# EasyEDA Pro project ProPrj_Altruist.epro, schematic Schematic Altruist
Board Name: Altruist_core_ESP32C3mini; Create Date: 2024-12-25; Page Name: P1; Project Name: Altruist rc: v0.1.1; Schematic Name: Altruist_Schematic; Update Date: 2025-01-15; Company: Robonomics.network; Drawn: chegurov; Page Size: A4; Part Number: Robo_altruist; Reviewed: ludovich88; Version: V0.1
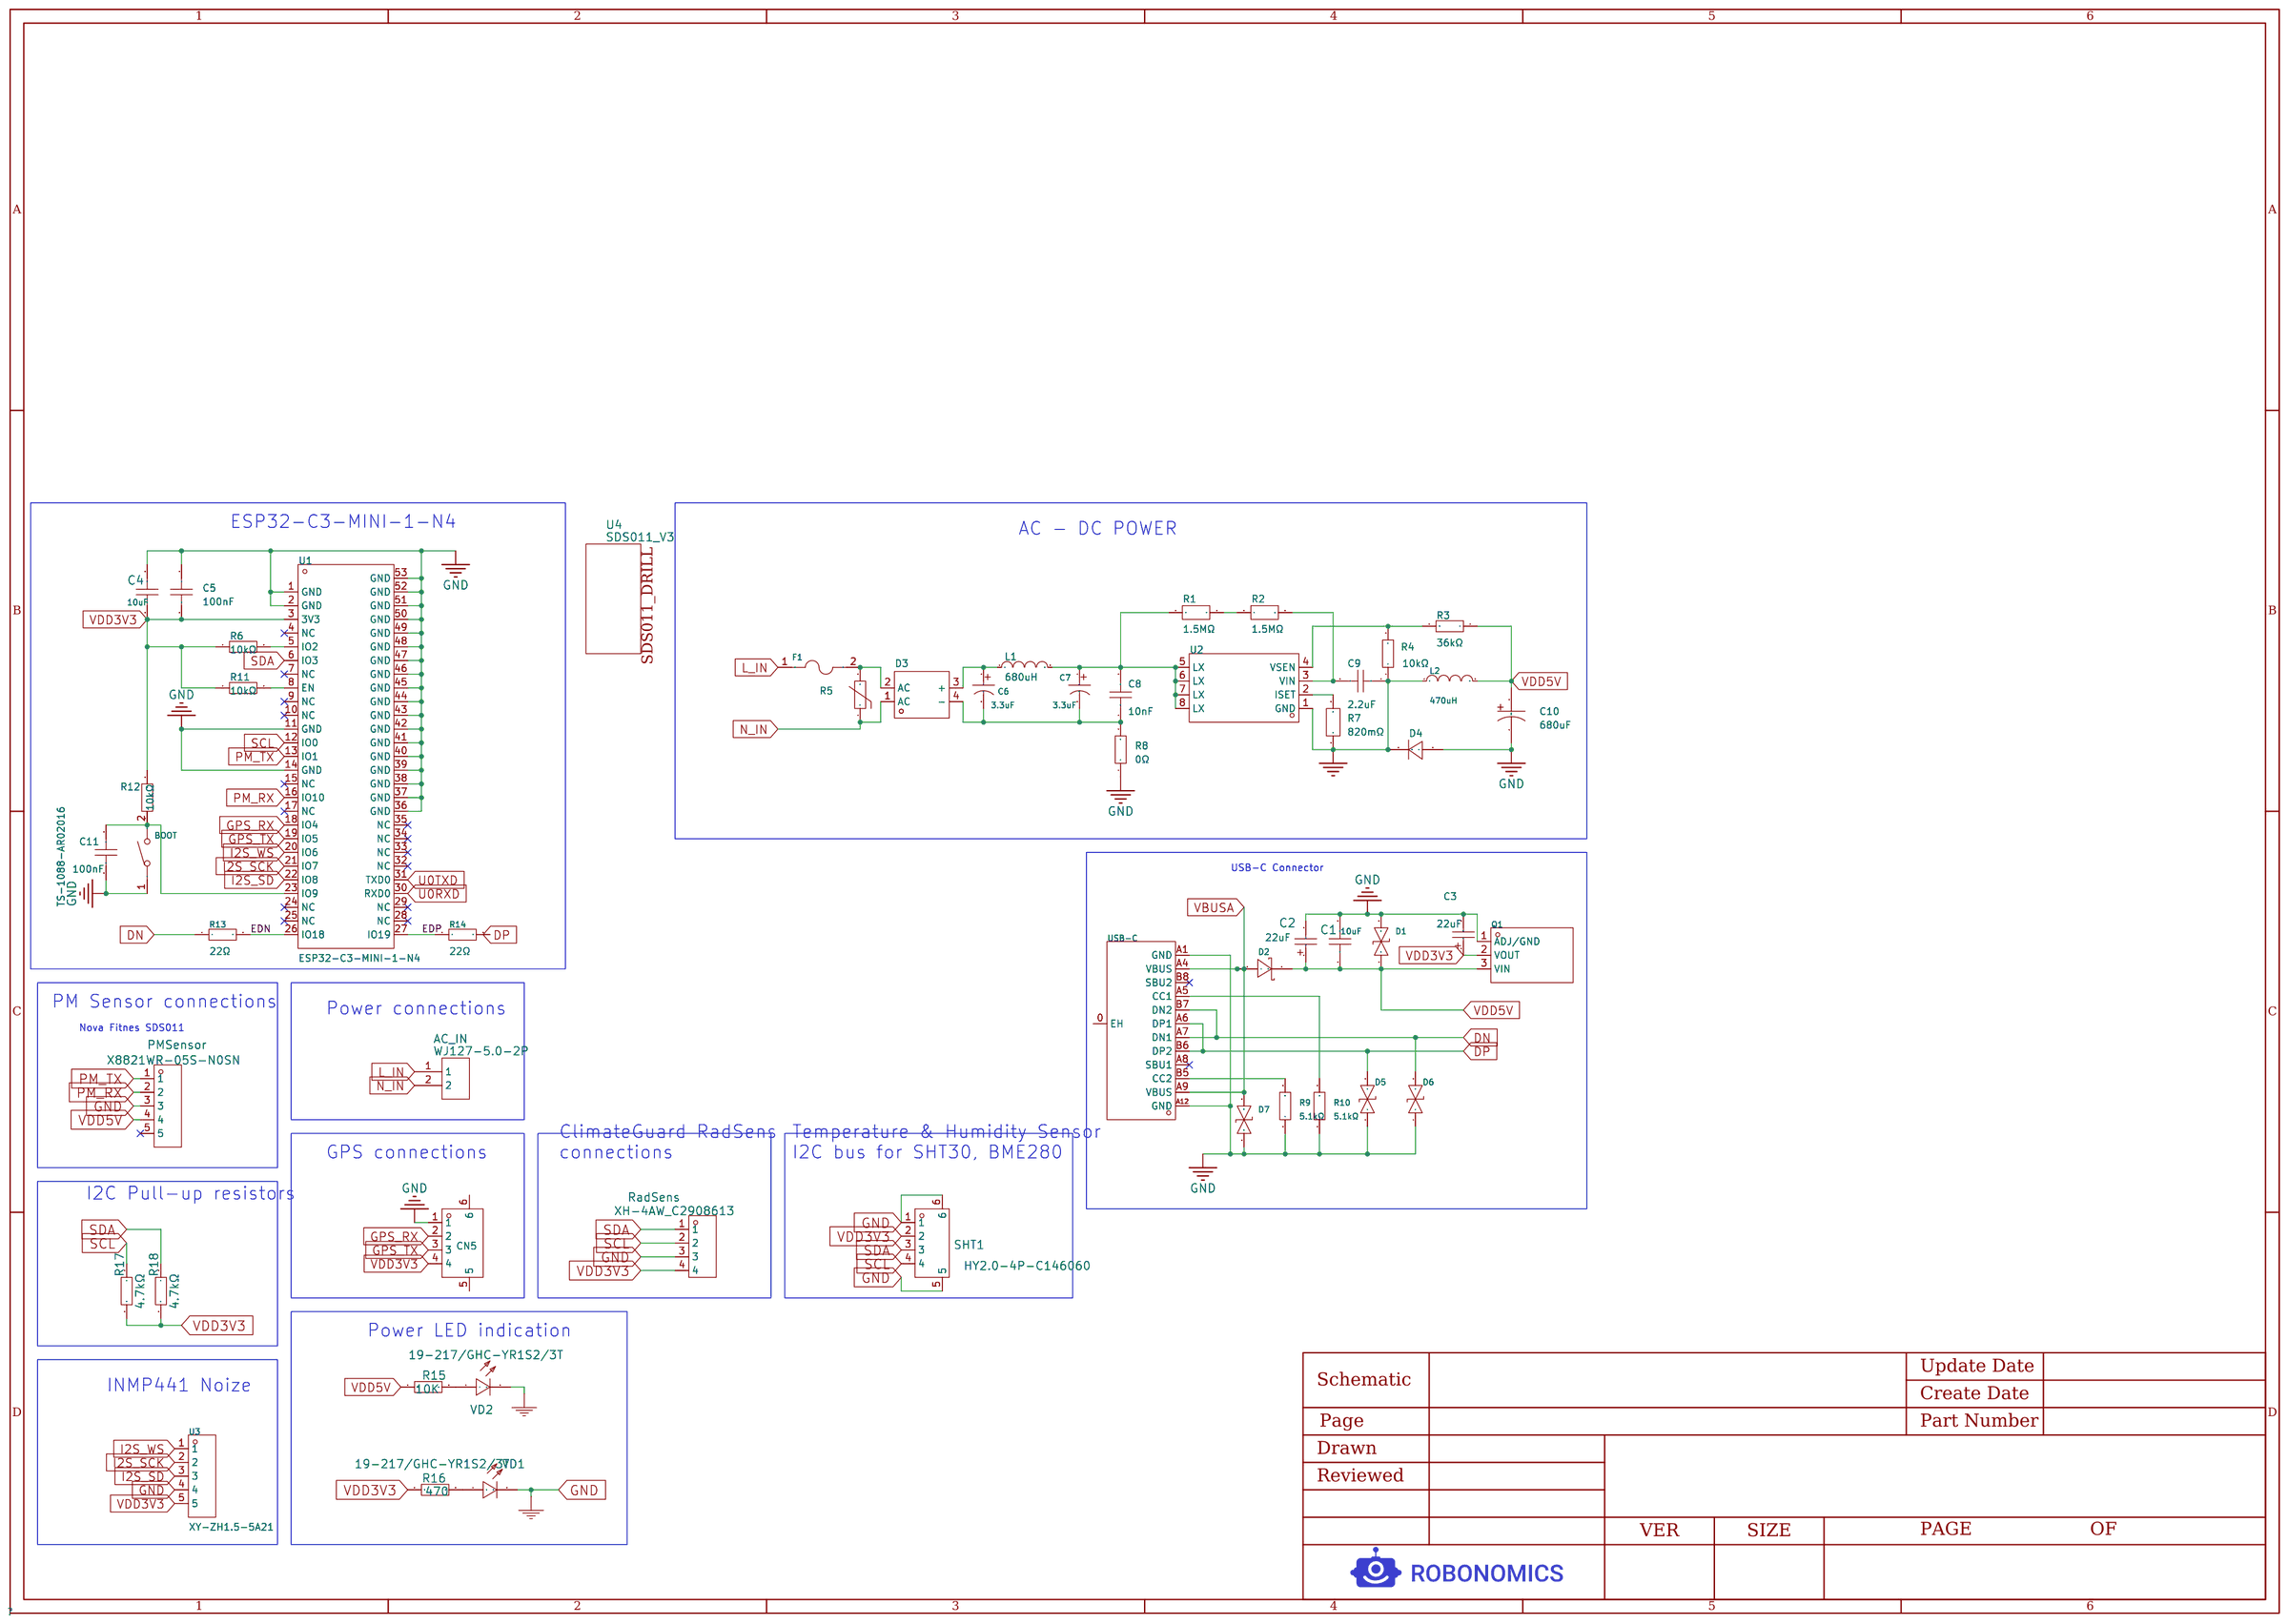
[diagram p2: schematic sheet]

## Parts
AC_IN  WJ127-5.0-2P  [CONN-TH_2P-P5.00_CPC3703CTR]
BOOT  TS-1088-AR02016  [SW-SMD_L3.9-W3.0-P4.45]
C1  22uF  [CASE-A_3216]
C2  10uF  [C0603]
C3  22uF  [CASE-A_3216]
C4  10uF  [C0603]
C5  100nF  [C0402]
C6  3.3uF  [CAP-SMD_BD8.0-L8.3-W8.3-FD]
C7  3.3uF  [CAP-SMD_BD8.0-L8.3-W8.3-FD]
C8  10nF  [C1206]
C9  2.2uF  [C0805]
C10  680uF  [CAP-SMD_L7.3-W4.3]
C11  100nF  [C0402]
CN5  ZX-SH1.0-4PWT  [CONN-SMD_4P-P1.00_MEGASTAR_ZX-SH1.0-4PWT]
D1  LESD5D5.0CT1G  [SOD-523_L1.2-W0.8-LS1.6-BI]
D2  1N5819WS  [SOD-323_L1.8-W1.3-LS2.5-RD]
D3  MB10F  [MBF_L4.8-W3.9-P2.50-LS6.7-BL]
D4  ES1J  [SMA_L4.3-W2.6-LS5.2-RD]
D5  LESD5D5.0CT1G  [SOD-523_L1.2-W0.8-LS1.6-BI]
D6  LESD5D5.0CT1G  [SOD-523_L1.2-W0.8-LS1.6-BI]
D7  LESD5D5.0CT1G  [SOD-523_L1.2-W0.8-LS1.6-BI]
F1  JFC2410-1200FS  [F2410]
L1  680uH  [IND-SMD_L6.0-W6.0]
L2  470uH  [IND-SMD_L8.0-W8.0]
PMSensor  X8821WR-05S-N0SN  [CONN-TH_5P-P2.50_X8821WR-05S-N0SN]
Q1  AMS1117-3.3V  [SOT-89-3_L4.5-W2.5-P1.50-LS4.2-BR]
R1  1.5MΩ  [R1206]
R2  1.5MΩ  [R1206]
R3  36kΩ  [R0805]
R4  10kΩ  [R0805]
R5  07D471K68RV0149  [RES-SMD_L8.2-W6.3]
R6  10kΩ  [R0402]
R7  820mΩ  [R0805]
R8  0Ω  [R0805]
R9  5.1kΩ  [R0402]
R10  5.1kΩ  [R0402]
R11  10kΩ  [R0402]
R12  10kΩ  [R0402]
R13  22Ω  [R0402]
R14  22Ω  [R0402]
R15  10K  [R0603]
R16  470  [R0603]
R17  4.7kΩ  [R0603]
R18  4.7kΩ  [R0603]
RadSens  XH-4AW_C2908613  [CONN-TH_XH-4AW]
SHT1  HY2.0-4P-C146060  [CONN-SMD_HY2.0-4P]
U1  ESP32-C3-MINI-1-N4  [WIFIM-SMD_ESP32-C3-MINI-1]
U2  SY50282FAC  [SOIC-8_L4.9-W3.9-P1.27-LS6.0-BL]
U3  XY-ZH1.5-5A21  [CONN-TH_ZH1.5-5AW_C2829750]
U4  SDS011_V3  [SDS011_V3]  (no BOM)
USB-C  TYPE-C 16P QTWT  [USB-TYPE-C-SMD_TYPE-C-16P-QTWT]
VD1  19-217/GHC-YR1S2/3T  [LED0603-R-RD]
VD2  19-217/GHC-YR1S2/3T  [LED0603-R-RD]

## Library data of the parts
AC_IN = WJ127-5.0-2P: Supplier: LCSC; Manufacturer: KANGNEX(康奈克斯电气); Supplier Part: C3703; JLCPCB Part Class: ExtendedPart; Check: true
BOOT = TS-1088-AR02016: Circuit:SPST Actuator Style:Round Button Operating Force:160gf Mounting Style:Brick nogging Switch Length:4mm Switch Width:3mm Switch Height:2mm Strike Gundam:不带 Contact Current:50mA Voltage Rating (DC):12V Insulation Resistance:100MΩ Actuator/Cap Color:B; LCSC Part Name: 4*3*2mm 立贴 轻触开关; Supplier Part: C720477; Manufacturer: XUNPU(讯普); Supplier Footprint: SMD; Datasheet: https://atta.szlcsc.com/upload/public/pdf/source/20200810/C720475_60D09DD6C54279ADDB2DC25100F1CC11.pdf; Supplier: LCSC; Circuit: SPST; Actuator Style: Round Button; Operating Force: 160gf; Mounting Style: Brick nogging; Switch Length: 4mm; Switch Width: 3mm; Switch Height: 2mm; Strike Gundam: 不带; Contact Current: 50mA; Voltage Rating (DC): 12V; Insulation Resistance: 100MΩ; Actuator/Cap Color: Black; Pin Style: SMDSplicing; Mechanical Life: 10万次; Operating Temperature: -30℃~+80℃; Check: true
C1 C3 = TAJA226K010RNJ: Capacitance: Tolerance:±10% Tolerance:±10% Rated Voltage: Equivalent Series Resistance(ESR):3Ω@100kHz Operating Temperature:-55℃~+125℃ Operating Temperature:-55℃~+125℃; LCSC Part Name: 22uF ±10% 10V; Supplier Part: C11366; Manufacturer: Kyocera AVX; JLCPCB Part Class: Extended Part; Datasheet: https://atta.szlcsc.com/upload/public/pdf/source/20160107/1457707744993.pdf; Supplier: LCSC; Tolerance: ±10%; Equivalent Series Resistance(ESR): 3Ω@100kHz; Operating Temperature: -55℃~+125℃; Check: true
C2 C4 = GRM188R61E106KA73D: Capacitance: Tolerance:±10% Tolerance:±10% Voltage Rated: Temperature Coefficient:; LCSC Part Name: 10uF ±10% 25V; Supplier Part: C344022; Manufacturer: muRata(村田); Supplier Footprint: 0603; JLCPCB Part Class: Extended Part; Datasheet: https://atta.szlcsc.com/upload/public/pdf/source/20181211/C344022_BB98D43E7DA95E5A749FBFE073C8A3E0.pdf; Supplier: LCSC; Tolerance: ±10%; Check: true
C5 C11 = 0402B104K500CT: Capacitance: Tolerance:±10% Tolerance:±10% Voltage Rated: Temperature Coefficient:; LCSC Part Name: 100nF ±10% 50V; Supplier Part: C152814; Manufacturer: Walsin(华新科); Supplier Footprint: 0402; JLCPCB Part Class: Extended Part; Datasheet: https://atta.szlcsc.com/upload/public/pdf/source/20191217/C469650_84AD5C6F618CF4AC0C6D987F2E8FE6F8.pdf; Supplier: LCSC; Tolerance: ±10%
C6 C7 = UV2G3R3M0810: Capacitance: Tolerance:±20% Tolerance:±20% Rated Voltage: Ripple Current:- Equivalent Series Resistance(ESR):- φD: L: Lifetime @ Temp:3000hrs@105℃ Operating Temperature:-45℃~+105℃ Operating Temperature:-45℃~+105℃; LCSC Part Name: 3.3uF ±20% 400V; Supplier Part: C98554; Manufacturer: HONOR(荣誉); Supplier Footprint: SMD,D8xL10.2mm; JLCPCB Part Class: Extended Part; Datasheet: https://atta.szlcsc.com/upload/public/pdf/source/20170311/1489227743043.pdf; Supplier: LCSC; Tolerance: ±20%; Lifetime @ Temp: 3000hrs@105℃; Operating Temperature: -45℃~+105℃; Check: true
C8 = 1206B103K102CT_C77498: Capacitance: Tolerance:±10% Tolerance:±10% Voltage Rated: Temperature Coefficient:; LCSC Part Name: 10nF±10%1kV; Supplier Part: C77498; Manufacturer: Walsin(华新科); Manufacturer Part: 1206B103K102CT; Supplier Footprint: 1206; Datasheet: https://atta.szlcsc.com/upload/public/pdf/source/20180823/C77498_F5DB9DEE771DDE1CDD0779C01702A5D3.pdf; Supplier: LCSC; Tolerance: ±10%; Check: true
C9 = CL21A225KBQNNNE: Capacitance: Tolerance:±10% Tolerance:±10% Voltage Rated: Temperature Coefficient:; LCSC Part Name: 2.2uF±10%50V; Supplier Part: C377773; Manufacturer: SAMSUNG(三星); Supplier Footprint: 0805; JLCPCB Part Class: ExtendedPart; Datasheet: https://atta.szlcsc.com/upload/public/pdf/source/20190327/C377773_F663556E8B678C5EA7A210E6B154453B.pdf; Supplier: LCSC; Tolerance: ±10%; Check: true
C10 = TAJE687K006RNJ: Capacitance: Tolerance:±10% Tolerance:±10% Rated Voltage: Equivalent Series Resistance(ESR):500mΩ@100kHz Operating Temperature:-55℃~+125℃ Operating Temperature:-55℃~+125℃; LCSC Part Name: 680uF±10%6.3V; Supplier Part: C308811; Manufacturer: KyoceraAVX; Supplier Footprint: CASE-E-7343; JLCPCB Part Class: ExtendedPart; Datasheet: https://atta.szlcsc.com/upload/public/pdf/source/20181031/C308811_5A7B8BD02B1566F52935A1016FD2A024.pdf; Supplier: LCSC; Tolerance: ±10%; Equivalent Series Resistance(ESR): 500mΩ@100kHz; Operating Temperature: -55℃~+125℃; PinNumber: C20(3); Check: true
CN5 = ZX-SH1.0-4PWT: Pins Structure:1x4P Pitch:1mm Mounting Style:Horizontal attachment Reference Series:SH Number of Pins:4P Number of Rows:1 Number of PINs Per Row:4 Row Spacing:- Current Rating (Max):1A Contact Material:Brass Contact Plating:Tin Operating Temperature Range; LCSC Part Name: 配套胶壳型号：ZX-SH1.0-4PJK 配套端子型号：ZX-SH1.0-DZ 配套杜邦线型号：ZX-SH1.0-4PBXC; Supplier Part: C7430446; Manufacturer: Megastar(兆星); Supplier Footprint: SMD,P=1mm,卧贴; JLCPCB Part Class: Extended Part; Datasheet: https://atta.szlcsc.com/upload/public/pdf/source/20230619/390816C24B7A0EB1D042395C380CEA99.pdf; Supplier: LCSC; Pins Structure: 1x4P; Pitch: 1mm; Mounting Style: Horizontal attachment; Reference Series: SH; Number of Pins: 4P; Number of Rows: 1; Number of PINs Per Row: 4; Current Rating (Max): 1A; Contact Material: Brass; Contact Plating: Tin; Operating Temperature Range: -25℃~+85℃
D1 D5-D7 = LESD5D5.0CT1G: polarity:Bi-Directional Reverse Stand-Off Voltage (Vrwm):5V Maximum Clamping Voltage:18.6V Peak Pulse Current (Ipp)@10/1000us:9.4A Breakdown Voltage:5.6V Type:ESD; LCSC Part Name: 双向ESD; Supplier Part: C383211; Manufacturer: LRC(乐山无线电); Supplier Footprint: SOD-523; JLCPCB Part Class: Extended Part; Datasheet: https://atta.szlcsc.com/upload/public/pdf/source/20190807/C383211_633DF4B4E2C161403226E5235FE33A1C.pdf; Supplier: LCSC; polarity: Bi-Directional; Reverse Stand-Off Voltage (Vrwm): 5V; Maximum Clamping Voltage: 18.6V; Peak Pulse Current (Ipp)@10/1000us: 9.4A; Breakdown Voltage: 5.6V; Type: ESD; Check: true
D2 = 1N5819WS_C191023: Forward Voltage (Vf@If):600mV@1A Reverse Voltage (Vr):40V Average Rectified Current (Io):1A; LCSC Part Name: 电压:40V 电流:1A; Supplier Part: C191023; Manufacturer: Hottech(合科泰); Supplier Footprint: SOD-323; JLCPCB Part Class: Basic Part; Datasheet: https://atta.szlcsc.com/upload/public/pdf/source/20220428/3CB86FD8D28D653594B4E35F9D5AEFD9.pdf; Supplier: LCSC; Forward Voltage (Vf@If): 600mV@1A; Reverse Voltage (Vr): 40V; Average Rectified Current (Io): 1A; Check: true
D3 = MB10F_C306850: Reverse Voltage (Vr): Average Rectified Current (Io): Forward Voltage (Vf@If):1V@500mA Reverse Leakage Current (Ir):5uA@1kV Peak Forward Surge Current: Operating Temperature:-55℃~+150℃@(Tj) Operating Temperature:-55℃~+150℃@(Tj); LCSC Part Name: 1kV800mA; Supplier Part: C306850; Manufacturer: BORN(伯恩半导体); Supplier Footprint: MBF; JLCPCB Part Class: ExtendedPart; Datasheet: https://atta.szlcsc.com/upload/public/pdf/source/20180927/C306850_59365E2CFC1E948275A4282033719DF3.pdf; Supplier: LCSC; Forward Voltage (Vf@If): 1V@500mA; Reverse Leakage Current (Ir): 5uA@1kV; Operating Temperature: -55℃~+150℃@(Tj); Check: true
D4 = ES1J_C115404: Supplier Part: C115404; Manufacturer: 晶导微电子; Supplier Footprint: SMA(DO-214AC); Datasheet: https://atta.szlcsc.com/upload/public/pdf/source/20170704/1499151315665.pdf; Supplier: LCSC; Check: true
F1 = JFC2410-1200FS: Type:SMD Fuse Current Rating:2A Voltage Rating  (AC):250V Breaking Capacity:50A Operating Temperature:-55℃~+125℃ Operating Temperature:-55℃~+125℃; LCSC Part Name: 250V贴片式保险丝; Supplier Part: C136365; Manufacturer: JDTfuse(集电通); Supplier Footprint: SMD; JLCPCB Part Class: Extended Part; Datasheet: https://atta.szlcsc.com/upload/public/pdf/source/20230515/4DD82964BD259009D7CA201DAB95185E.pdf; Supplier: LCSC; Type: SMD Fuse; Current Rating: 2A; Voltage Rating  (AC): 250V; Breaking Capacity: 50A; Operating Temperature: -55℃~+125℃; Check: true
L1 = YNR6045-681M: Inductance: Tolerance:±20% Tolerance:±20% Rated Current: DC Resistance (DCR):; LCSC Part Name: 680uH±20%330mA2.5Ω; Supplier Part: C497844; Manufacturer: YJYCOIN(益嘉源); Supplier Footprint: SMD,6x6mm; JLCPCB Part Class: ExtendedPart; Datasheet: https://atta.szlcsc.com/upload/public/pdf/source/20200317/C497838_ADAADDA66AFC043F2D8B9A62FB946728.pdf; Supplier: LCSC; Tolerance: ±20%; Check: true
L2 = YNR8040-471M: Inductance: Tolerance:±20% Tolerance:±20% Rated Current: DC Resistance (DCR):; LCSC Part Name: 470uH ±20%; Supplier Part: C341087; Manufacturer: YJYCOIN(益嘉源); Supplier Footprint: SMD,8x8mm; JLCPCB Part Class: Extended Part; Datasheet: https://atta.szlcsc.com/upload/public/pdf/source/20200623/C341071_F21EEFD9E09726BE7F1E59D5EF4DFB9E.pdf; Supplier: LCSC; Tolerance: ±20%
PMSensor = X8821WR-05S-N0SN: Supplier: LCSC; Supplier Part: C388742; Manufacturer: XKBConnectivity(中国星坤); JLCPCB Part Class: ExtendedPart; Check: true
Q1 = AMS1117-3.3V_C5120796: Output Type: Maximum Input Voltage:18V Output Voltage:3.3V Output Voltage:3.3V MAX Output Current:1A Dropout Voltage:1.4V@(1A) standby current:12mA Operating Temperature:0℃~+125℃ Operating Temperature:0℃~+125℃ Output Polarity:Positive electrode Number of; LCSC Part Name: 输入18V 输出3.3V 1A; Supplier Part: C5120796; Manufacturer: MSKSEMI(美森科); Supplier Footprint: SOT-89; JLCPCB Part Class: Extended Part; Datasheet: https://atta.szlcsc.com/upload/public/pdf/source/20231123/6117526697EB8BF6175FDEEBA0877266.pdf; Supplier: LCSC; Maximum Input Voltage: 18V; Output Voltage: 3.3V; MAX Output Current: 1A; Dropout Voltage: 1.4V@(1A); standby current: 12mA; Operating Temperature: 0℃~+125℃; Output Polarity: Positive electrode; Number of Outputs: 1; Check: true
R1 R2 = AC1206FR-071M5L: Power(Watts):250mW Body Length:- Tolerance: Operating Temperature Range: Operating Temperature Range: φD:- Body Height:- Resistance: Body Width:- Type:Thick Film Resistors Temperature Coefficient: Temperature Coefficient: Overload Voltage (Max):; LCSC Part Name: 1.5MΩ±1%; Supplier Part: C229411; Manufacturer: YAGEO(国巨); Supplier Footprint: 1206; JLCPCB Part Class: ExtendedPart; Datasheet: https://atta.szlcsc.com/upload/public/pdf/source/20190415/C229411_FA1574342AB9C159EA3612F925293BBE.pdf; Supplier: LCSC; Power(Watts): 250mW; Type: ThickFilmResistors; Check: true
R3 = 0805W8F3602T5E: Type:Thick Film Resistors Resistance: Tolerance:±1% Tolerance:±1% Power(Watts): Temperature Coefficient:±100ppm/℃ Temperature Coefficient:±100ppm/℃ Overload Voltage (Max): Operating Temperature Range:-55℃~+155℃ Operating Temperature Range:-55℃~+155℃; LCSC Part Name: 36kΩ±1%125mW; Supplier Part: C4360; Manufacturer: UNI-ROYAL(厚声); Supplier Footprint: 0805; JLCPCB Part Class: BasicPart; Datasheet: https://atta.szlcsc.com/upload/public/pdf/source/20200306/C422600_1E6D84923E4A46A82E41ADD87F860B5C.pdf; Supplier: LCSC; Type: ThickFilmResistors; Tolerance: ±1%; Temperature Coefficient: ±100ppm/℃; Operating Temperature Range: -55℃~+155℃; Check: true
R4 = 0805W8F1002T5E: Type:Thick Film Resistors Resistance: Tolerance:±1% Tolerance:±1% Power(Watts): Temperature Coefficient:±100ppm/℃ Temperature Coefficient:±100ppm/℃ Overload Voltage (Max): Operating Temperature Range:-55℃~+155℃ Operating Temperature Range:-55℃~+155℃; LCSC Part Name: 10kΩ±1%125mW; Supplier Part: C17414; Manufacturer: UNI-ROYAL(厚声); Supplier Footprint: 0805; JLCPCB Part Class: BasicPart; Datasheet: https://atta.szlcsc.com/upload/public/pdf/source/20200306/C422600_1E6D84923E4A46A82E41ADD87F860B5C.pdf; Supplier: LCSC; Type: ThickFilmResistors; Tolerance: ±1%; Temperature Coefficient: ±100ppm/℃; Operating Temperature Range: -55℃~+155℃; Check: true
R5 = 07D471K68RV0149: Allowable Voltage (AC): Allowable Voltage (DC): Varistor Voltage:423V~517V Varistor Voltage:423V~517V Clamping Voltage: Peak Current: Maximum Energy:20J Maximum Energy:20J Typical Capatitance:140pF@1kHz; LCSC Part Name: 贴片 775V 20焦耳; Supplier Part: C2836432; Manufacturer: KNSCHA(科尼盛); Supplier Footprint: SMD,3225; JLCPCB Part Class: Extended Part; Datasheet: https://atta.szlcsc.com/upload/public/pdf/source/20220505/AA8F3A0EE096C907DE4148B38AA17D85.pdf; Supplier: LCSC; Varistor Voltage: 423V~517V; Maximum Energy: 20J; Typical Capatitance: 140pF@1kHz; PinNumber: R29(3,4); Check: true
R6 R11 R12 = RC0402FR-0710KL: Type:Thick Film Resistors Resistance: Tolerance:±1% Tolerance:±1% Power(Watts): Overload Voltage (Max): Temperature Coefficient:±100ppm/℃ Temperature Coefficient:±100ppm/℃ Operating Temperature Range:-55℃~+155℃ Operating Temperature Range:-55℃~+155℃; LCSC Part Name: 厚膜电阻 10kΩ ±1% 62.5mW; Supplier Part: C60490; Manufacturer: YAGEO(国巨); Supplier Footprint: 0402; Datasheet: https://atta.szlcsc.com/upload/public/pdf/source/20170925/C131467_1506321478108990263.pdf; Supplier: LCSC; Type: Thick Film Resistors; Tolerance: ±1%; Temperature Coefficient: ±100ppm/℃; Operating Temperature Range: -55℃~+155℃; Check: true
R7 = 0805W8F820LT5E: Resistance:820mΩ Tolerance:±1% Tolerance:±1% Power(Watts): Overload Voltage (Max): Temperature Coefficient:±800ppm/℃ Temperature Coefficient:±800ppm/℃ Type:Thick Film Resistors Operating Temperature Range:-55℃~+155℃ Operating Temperature Range:-55℃~+155℃; LCSC Part Name: 820mΩ ±1% 125mW 厚膜电阻; Supplier Part: C25267; Manufacturer: UNI-ROYAL(厚声); Supplier Footprint: 0805; JLCPCB Part Class: Extended Part; Datasheet: https://atta.szlcsc.com/upload/public/pdf/source/20200306/C422600_1E6D84923E4A46A82E41ADD87F860B5C.pdf; Supplier: LCSC; Tolerance: ±1%; Temperature Coefficient: ±800ppm/℃; Type: Thick Film Resistors; Operating Temperature Range: -55℃~+155℃; Check: true
R8 = 0805W8J0000T5E: Type:Thick Film Resistors Resistance: Tolerance:±5% Tolerance:±5% Power(Watts): Overload Voltage (Max): Operating Temperature Range:-55℃~+155℃ Operating Temperature Range:-55℃~+155℃; LCSC Part Name: 0Ω±5%125mW; Supplier Part: C25275; Manufacturer: UNI-ROYAL(厚声); Supplier Footprint: 0805; Datasheet: https://atta.szlcsc.com/upload/public/pdf/source/20200306/C422600_1E6D84923E4A46A82E41ADD87F860B5C.pdf; Supplier: LCSC; Type: ThickFilmResistors; Tolerance: ±5%; Operating Temperature Range: -55℃~+155℃; Check: true
R9 R10 = 0402WGF5101TCE: Type:Thick Film Resistors Resistance:5.1kΩ Tolerance:±1% Tolerance:±1% Power(Watts): Overload Voltage (Max): Temperature Coefficient:±100ppm/℃ Temperature Coefficient:±100ppm/℃ Operating Temperature Range:-55℃~+155℃ Operating Temperature Range:-55℃~+155℃; LCSC Part Name: 5.1kΩ ±1% 62.5mW 厚膜电阻; Supplier Part: C25905; Manufacturer: UNI-ROYAL(厚声); Supplier Footprint: 0402; JLCPCB Part Class: Basic Part; Datasheet: https://atta.szlcsc.com/upload/public/pdf/source/20200306/C422600_1E6D84923E4A46A82E41ADD87F860B5C.pdf; Supplier: LCSC; Type: Thick Film Resistors; Tolerance: ±1%; Temperature Coefficient: ±100ppm/℃; Operating Temperature Range: -55℃~+155℃
R13 R14 = 0402WGF220JTCE: Type:Thick Film Resistors Resistance:22Ω Tolerance:±1% Tolerance:±1% Power(Watts): Overload Voltage (Max): Temperature Coefficient:±100ppm/℃ Temperature Coefficient:±100ppm/℃ Operating Temperature Range:-55℃~+155℃ Operating Temperature Range:-55℃~+155℃; LCSC Part Name: 22Ω ±1% 62.5mW 厚膜电阻; Supplier Part: C25092; Manufacturer: UNI-ROYAL(厚声); Supplier Footprint: 0402; JLCPCB Part Class: Basic Part; Datasheet: https://atta.szlcsc.com/upload/public/pdf/source/20200306/C422600_1E6D84923E4A46A82E41ADD87F860B5C.pdf; Supplier: LCSC; Type: Thick Film Resistors; Tolerance: ±1%; Temperature Coefficient: ±100ppm/℃; Operating Temperature Range: -55℃~+155℃; Check: true
R15 = 0603WAF1002T5E: Supplier: LCSC; Manufacturer: UniOhm; Supplier Part: C25804; JLCPCB Part Class: BasicPart; Check: true
R16 = 0603WAF4700T5E: Supplier: LCSC; Manufacturer: UniOhm; Supplier Part: C23179; JLCPCB Part Class: BasicPart; Check: true
R17 R18 = 0603WAF4701T5E: Supplier: LCSC; Manufacturer: UniOhm; Supplier Part: C23162; JLCPCB Part Class: BasicPart; Check: true
RadSens = XH-4AW: Supplier: LCSC; Supplier Part: C2908613; Manufacturer: HCTL(华灿天禄); JLCPCB Part Class: ExtendedPart; Check: true
SHT1 = HY-4P卧贴: Supplier: LCSC; Supplier Part: C146060; Manufacturer: BOOMELE(博穆精密); JLCPCB Part Class: ExtendedPart; Check: true
U1 = ESP32-C3-MINI-1-N4: Supplier Part: C2838502; Manufacturer: ESPRESSIF(乐鑫); Supplier Footprint: SMD,13.2x16.6mm; JLCPCB Part Class: Extended Part; Datasheet: https://atta.szlcsc.com/upload/public/pdf/source/20210720/C2838502_820C448AE0C4DF1D4546A4A5DCA77C73.pdf; Supplier: LCSC; Check: true
U2 = SY50282FAC: Supplier Part: C178237; Manufacturer: silergy(矽力杰); Supplier Footprint: SOIC-8; JLCPCB Part Class: ExtendedPart; Datasheet: https://atta.szlcsc.com/upload/public/pdf/source/20180207/C178237_15179896323851356347.pdf; Supplier: LCSC; Check: true
U3 = XY-ZH1.5-5A21: Pins Structure:1x5P Pitch:1.5mm Mounting Style:Right-Angle Number of Pins:5P Number of Rows:1 Number of PINs Per Row:5 Row Spacing:1.5mm Current Rating (Max):2A Operating Temperature Range:-25℃~+85℃ Operating Temperature Range:-25℃~+85℃; LCSC Part Name: 1x5P 间距:1.5mm 弯插; Supplier Part: C19271329; Manufacturer: XYECONN(辛译); Supplier Footprint: 弯插,P=1.5mm; JLCPCB Part Class: Extended Part; Datasheet: https://atta.szlcsc.com/upload/public/pdf/source/20231124/99483C09F6921F0DD5A4CFB6CD0D64B4.pdf; Supplier: LCSC; Pins Structure: 1x5P; Pitch: 1.5mm; Mounting Style: Right-Angle; Number of Pins: 5P; Number of Rows: 1; Number of PINs Per Row: 5; Row Spacing: 1.5mm; Current Rating (Max): 2A; Operating Temperature Range: -25℃~+85℃; Check: true
U4 = SDS011_V3: Check: true
USB-C = TYPE-C 16P QTWT: Connector Type:Type-C Standard:- Gender:Female Number of Ports:1 Number of Contacts:16P Mounting Style:卧贴 Current Rating - Power (Max):3A Contact Material:- Contact Plating:- Operating Temperature Range:-25℃~+85℃ Operating Temperature Range:-25℃~+85℃ Sold; LCSC Part Name: Type-C 母 卧贴; Supplier Part: C5187472; Manufacturer: SHOU HAN(首韩); Supplier Footprint: SMD; JLCPCB Part Class: Extended Part; Datasheet: https://atta.szlcsc.com/upload/public/pdf/source/20220929/9CA39B32C19F2C1116A695DA9353B6B2.pdf; Supplier: LCSC; Connector Type: Type-C; Gender: Female; Number of Ports: 1; Number of Contacts: 16P; Mounting Style: 卧贴; Current Rating - Power (Max): 3A; Operating Temperature Range: -25℃~+85℃; Check: true
VD1 VD2 = 19-217/GHC-YR1S2/3T: Supplier: LCSC; Manufacturer: EVERLIGHT; Supplier Part: C72043; JLCPCB Part Class: BasicPart; Check: true

## Nets
GND: BOOT.1 C1.2 C2.2 C3.2 C4.2 C5.1 C10.2 C11.2 CN5.1 D1.2 D4.2(A) D5.1 D6.1 D7.1 PMSensor.3 Q1.1(ADJ/GND) R8.1 R9.1 R10.1 RadSens.3 SHT1.1 SHT1.5 SHT1.6 U1.1(GND) U1.2(GND) U1.11(GND) U1.14(GND) U1.36(GND) U1.37(GND) U1.38(GND) U1.39(GND) U1.40(GND) U1.41(GND) U1.42(GND) U1.43(GND) U1.44(GND) U1.45(GND) U1.46(GND) U1.47(GND) U1.48(GND) U1.49(GND) U1.50(GND) U1.51(GND) U1.52(GND) U1.53(GND) U3.4 USB-C.A1(GND) USB-C.A12(GND) VD1.2(C) VD2.2(C)
GNDS: C9.1 D4.1(C) L2.1 R4.1 R7.1 U2.1(GND)
VBUSA: D2.2(A) D7.2 USB-C.A4(VBUS) USB-C.A9(VBUS)
VDD3V3: C3.1 C4.1 C5.2 CN5.4 Q1.2(VOUT) R6.1 R11.1 R12.2 R16.1 R17.2 R18.2 RadSens.4 SHT1.2 U1.3(3V3) U3.5
VDD5V: C1.1 C2.1 C10.1 D1.1 D2.1(K) L2.2 PMSensor.4 Q1.3(VIN) R3.1 R15.1
DN: D6.2 R13.1 USB-C.A7(DN1) USB-C.B7(DN2)
DP: D5.2 R14.2 USB-C.A6(DP1) USB-C.B6(DP2)
EDN: R13.2 U1.26(IO18)
EDP: R14.1 U1.27(IO19)
GPS_RX: CN5.2 U1.18(IO4)
GPS_TX: CN5.3 U1.19(IO5)
I2S_SCK: U1.21(IO7) U3.2
I2S_SD: U1.22(IO8) U3.3
I2S_WS: U1.20(IO6) U3.1
L_IN: AC_IN.1 F1.1
N_IN: AC_IN.2 D3.1(AC) R5.1
PM_RX: PMSensor.2 U1.16(IO10)
PM_TX: PMSensor.1 U1.13(IO1)
SCL: R17.1 RadSens.2 SHT1.4 U1.12(IO0)
SDA: R18.1 RadSens.1 SHT1.3 U1.6(IO3)
U0RXD: U1.30(RXD0)
U0TXD: U1.31(TXD0)
$1N20079: R15.2 VD2.1(A)
$1N20100: R16.2 VD1.1(A)
$1N20115: R1.2 R2.1
$1N20116: R7.2 U2.2(ISET)
$1N20117: C9.2 R2.2 U2.3(VIN)
$1N20118: R3.2 R4.2 U2.4(VSEN)
$1N20123: C6.1 D3.3(+) L1.1
$1N20125: D3.2(AC) F1.2 R5.2
$1N20128: C7.1 C8.2 L1.2 R1.1 U2.5(LX) U2.6(LX) U2.7(LX) U2.8(LX)
$1N20129: C6.2 C7.2 C8.1 D3.4(-) R8.2
$1N20204: R9.2 USB-C.B5(CC2)
$1N20205: R10.2 USB-C.A5(CC1)
$1N46971: R6.2 U1.5(IO2)
$1N46973: R11.2 U1.8(EN)
$1N50749: BOOT.2 C11.1 R12.1 U1.23(IO9)

Not connected (* = marked no-connect by the designer): CN5 5 6; PMSensor 5*; U1 4(NC)* 7(NC)* 9(NC)* 10(NC)* 15(NC)* 17(NC)* 24(NC)* 25(NC)* 28(NC)* 29(NC)* 32(NC)* 33(NC)* 34(NC)* 35(NC)*; USB-C 0(EH) A8(SBU1)* B8(SBU2)*

## Notes on the sheet
- ESP32-C3-MINI-1-N4
- AC - DC POWER
- USB-C Connector
- PM Sensor connections
- Power connections
- Nova Fitnes SDS011
- GPS connections
- ClimateGuard RadSens
  connections
- Temperature & Humidity Sensor
  I2C bus for SHT30, BME280
- I2C Pull-up resistors
- Power LED indication
- INMP441 Noize
